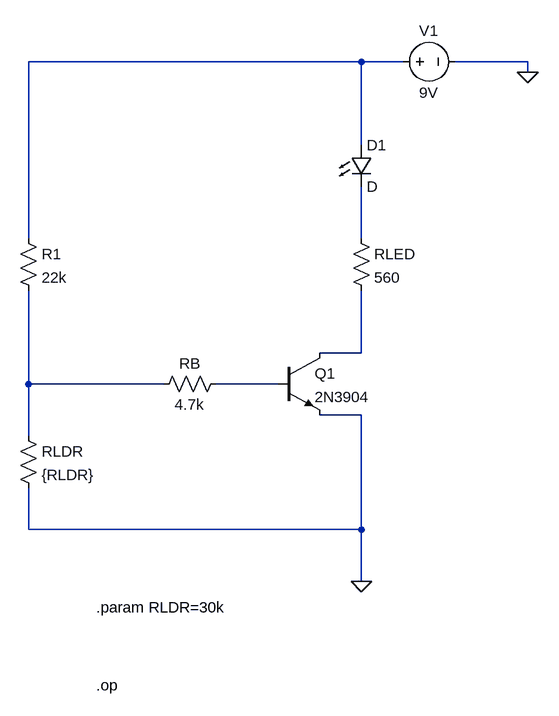
[diagram p0: schematic Automatic_Night_Lamp.asc]
Automatic_Night_Lamp.asc, the LTspice schematic file:
Version 4.1
SHEET 1 1788 720
WIRE 608 -288 96 -288
WIRE 672 -288 608 -288
WIRE 864 -288 752 -288
WIRE 864 -272 864 -288
WIRE 608 -160 608 -288
WIRE 96 -16 96 -288
WIRE 608 -16 608 -96
WIRE 608 160 608 64
WIRE 608 160 544 160
WIRE 96 208 96 64
WIRE 304 208 96 208
WIRE 480 208 384 208
WIRE 608 256 544 256
WIRE 96 288 96 208
WIRE 96 432 96 368
WIRE 608 432 608 256
WIRE 608 432 96 432
WIRE 608 512 608 432
FLAG 608 512 0
FLAG 864 -272 0
SYMBOL res 80 -32 R0
SYMATTR InstName R1
SYMATTR Value 22k
SYMBOL res 80 272 R0
SYMATTR InstName RLDR
SYMATTR Value {RLDR}
SYMBOL res 400 192 R90
WINDOW 0 0 56 VBottom 2
WINDOW 3 32 56 VTop 2
SYMATTR InstName RB
SYMATTR Value 4.7k
SYMBOL res 592 -32 R0
SYMATTR InstName RLED
SYMATTR Value 560
SYMBOL npn 480 160 R0
SYMATTR InstName Q1
SYMATTR Value 2N3904
SYMBOL voltage 656 -288 R270
WINDOW 0 32 56 VTop 2
WINDOW 3 -32 56 VBottom 2
WINDOW 123 0 0 Left 0
WINDOW 39 0 0 Left 0
SYMATTR InstName V1
SYMATTR Value 9V
SYMBOL LED 592 -160 R0
SYMATTR InstName D1
TEXT 200 552 Left 2 !.param RLDR=30k
TEXT 200 672 Left 2 !.op

The netlist it stands for:
* Automatic_Night_Lamp.asc
R1 N001 N004 22k
RLDR N004 0 {RLDR}
RB N005 N004 4.7k
RLED N002 N003 560
Q1 N003 N005 0 0 2N3904
V1 N001 0 9V
D1 N001 N002 D
.model D D
.lib standard.dio
.model NPN NPN
.model PNP PNP
.lib standard.bjt
.param RLDR=30k
.op
.backanno
.end